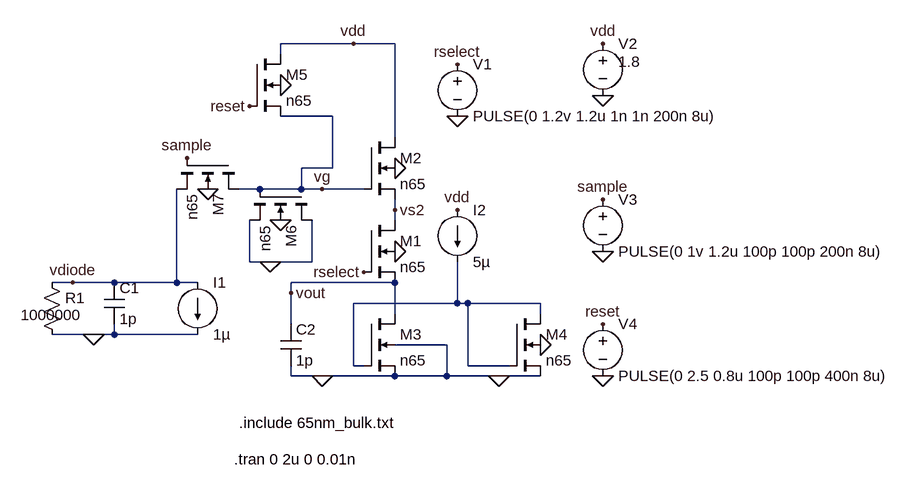
[diagram p0: schematic 4t pixel.asc]
4t pixel.asc, the LTspice schematic file:
Version 4.1
SHEET 1 1672 680
WIRE 816 -240 704 -240
WIRE 880 -240 816 -240
WIRE 704 -224 704 -240
WIRE 784 -128 704 -128
WIRE 880 -96 880 -240
WIRE 784 -48 784 -128
WIRE 784 -48 736 -48
WIRE 672 -16 640 -16
WIRE 736 -16 736 -48
WIRE 736 -16 672 -16
WIRE 768 -16 736 -16
WIRE 832 -16 768 -16
WIRE 880 16 880 0
WIRE 880 32 880 16
WIRE 656 96 656 32
WIRE 688 96 656 96
WIRE 752 96 752 32
WIRE 752 96 688 96
WIRE 384 128 352 128
WIRE 448 128 384 128
WIRE 544 128 544 -16
WIRE 544 128 448 128
WIRE 576 128 544 128
WIRE 880 128 720 128
WIRE 720 144 720 128
WIRE 976 160 976 96
WIRE 976 160 816 160
WIRE 992 160 976 160
WIRE 1104 160 992 160
WIRE 880 176 880 128
WIRE 1104 176 1104 160
WIRE 720 192 720 144
WIRE 416 208 352 208
WIRE 448 208 448 192
WIRE 448 208 416 208
WIRE 576 208 448 208
WIRE 960 224 880 224
WIRE 816 256 816 160
WIRE 832 256 816 256
WIRE 992 256 992 160
WIRE 1056 256 992 256
WIRE 720 272 720 256
WIRE 768 272 720 272
WIRE 880 272 768 272
WIRE 960 272 960 224
WIRE 960 272 880 272
WIRE 1040 272 960 272
WIRE 1104 272 1040 272
FLAG 416 208 0
FLAG 1040 272 0
FLAG 880 80 0
FLAG 1104 224 0
FLAG 880 -48 0
FLAG 704 -176 0
FLAG 704 32 0
FLAG 592 -16 0
FLAG 976 -128 0
FLAG 1200 -160 0
FLAG 1200 80 0
FLAG 1200 272 0
FLAG 1200 192 reset
FLAG 656 -144 reset
FLAG 1200 -240 vdd
FLAG 816 -240 vdd
FLAG 1200 0 sample
FLAG 560 -64 sample
FLAG 976 -208 rselect
FLAG 832 112 rselect
FLAG 768 -16 vg
FLAG 720 144 vout
FLAG 880 16 vs2
FLAG 976 16 vdd
FLAG 768 272 0
FLAG 384 128 vdiode
FLAG 688 96 0
SYMBOL res 336 112 R0
WINDOW 3 -32 66 Left 2
SYMATTR Value 1000000
SYMATTR InstName R1
SYMBOL cap 432 128 R0
SYMATTR InstName C1
SYMATTR Value 1p
SYMBOL current 576 128 R0
WINDOW 123 0 0 Left 0
WINDOW 39 0 0 Left 0
SYMATTR InstName I1
SYMATTR Value 1µ
SYMBOL current 976 16 R0
WINDOW 123 0 0 Left 0
WINDOW 39 0 0 Left 0
SYMATTR InstName I2
SYMATTR Value 5µ
SYMBOL nmos4 832 32 R0
SYMATTR InstName M1
SYMATTR Value n65
SYMATTR Value2 l=65n w=2u
SYMBOL nmos4 832 -96 R0
SYMATTR InstName M2
SYMATTR Value n65
SYMATTR Value2 l=100n w=4u
SYMBOL nmos4 832 176 R0
SYMATTR InstName M3
SYMATTR Value n65
SYMATTR Value2 l=65n w=1u
SYMBOL nmos4 1056 176 R0
SYMATTR InstName M4
SYMATTR Value n65
SYMATTR Value2 l=65n w=1u
SYMBOL nmos4 656 -224 R0
SYMATTR InstName M5
SYMATTR Value n65
SYMATTR Value2 l=100n w=2u
SYMBOL nmos4 752 -16 R90
SYMATTR InstName M6
SYMATTR Value n65
SYMATTR Value2 l=8u w=8u
SYMBOL nmos4 640 -64 R90
SYMATTR InstName M7
SYMATTR Value n65
SYMATTR Value2 l=300n w=4u
SYMBOL voltage 976 -224 R0
WINDOW 123 0 0 Left 0
WINDOW 39 0 0 Left 0
SYMATTR InstName V1
SYMATTR Value PULSE(0 1.2v 1.2u 1n 1n 200n 8u)
SYMBOL voltage 1200 -256 R0
WINDOW 3 24 44 Left 2
WINDOW 123 0 0 Left 0
WINDOW 39 0 0 Left 0
SYMATTR Value 1.8
SYMATTR InstName V2
SYMBOL voltage 1200 -16 R0
WINDOW 123 0 0 Left 0
WINDOW 39 0 0 Left 0
SYMATTR InstName V3
SYMATTR Value PULSE(0 1v 1.2u 100p 100p 200n 8u)
SYMBOL voltage 1200 176 R0
WINDOW 123 0 0 Left 0
WINDOW 39 0 0 Left 0
SYMATTR InstName V4
SYMATTR Value PULSE(0 2.5 0.8u 100p 100p 400n 8u)
SYMBOL cap 704 192 R0
SYMATTR InstName C2
SYMATTR Value 1p
TEXT 640 344 Left 2 !.include 65nm_bulk.txt
TEXT 632 400 Left 2 !.tran 0 2u 0 0.01n

The netlist it stands for:
* 4t pixel.asc
R1 vdiode 0 1000000
C1 vdiode 0 1p
I1 vdiode 0 1µ
I2 vdd N001 5µ
M1 vs2 rselect vout 0 n65 l=65n w=2u
M2 vdd vg vs2 0 n65 l=100n w=4u
M3 vout N001 0 0 n65 l=65n w=1u
M4 N001 N001 0 0 n65 l=65n w=1u
M5 vdd reset vg 0 n65 l=100n w=2u
M6 0 vg 0 0 n65 l=8u w=8u
M7 vg sample vdiode 0 n65 l=300n w=4u
V1 rselect 0 PULSE(0 1.2v 1.2u 1n 1n 200n 8u)
V2 vdd 0 1.8
V3 sample 0 PULSE(0 1v 1.2u 100p 100p 200n 8u)
V4 reset 0 PULSE(0 2.5 0.8u 100p 100p 400n 8u)
C2 vout 0 1p
.model NMOS NMOS
.model PMOS PMOS
.lib standard.mos
.include 65nm_bulk.txt
.tran 0 2u 0 0.01n
.backanno
.end